# Altium project NewMem.PrjPcb
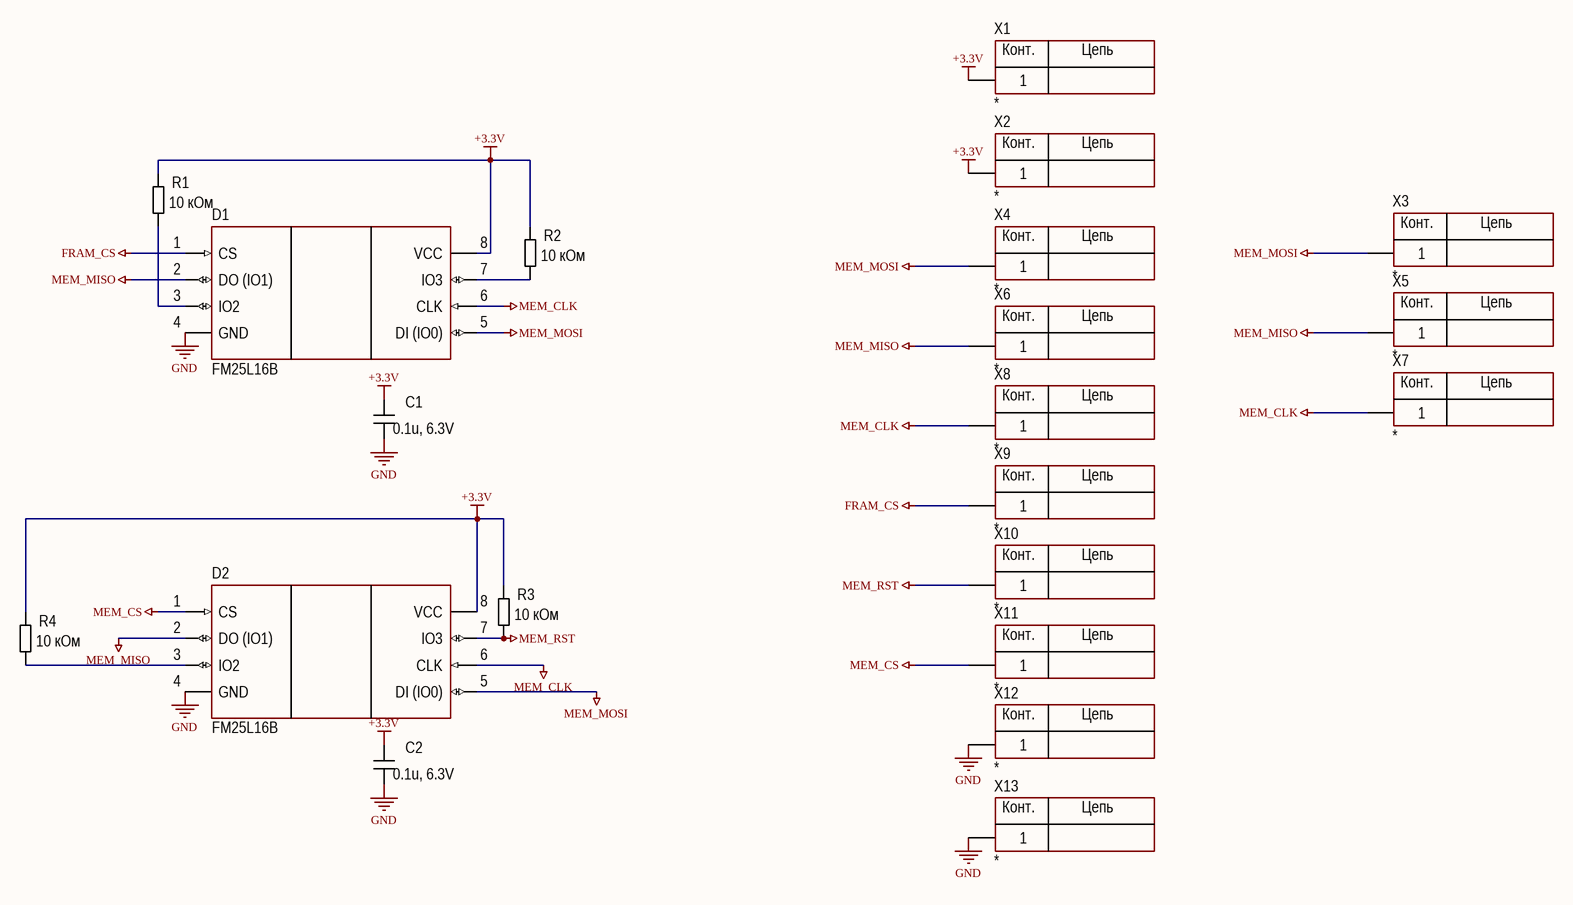
[diagram p0: Sheet1.SchDoc]
1 sheet, 21 parts. Net scope: global (net labels, ports and power ports of the same name join across sheets).
Board file: PCB2.PcbDoc

## Sheet Sheet1.SchDoc
size 414 x 293 mm; SheetNumber: 1; SheetTotal: 1

### Parts
C1  0.1u, 6.3V  [CH0805C]
C2  0.1u, 6.3V  [CH0805C]
D1  FM25L16B  [8-SOIC]
D2  FM25L16B  [8-SOIC]
R1  10 кОм  [CH1206R]
R2  10 кОм  [CH1206R]
R3  10 кОм  [CH1206R]
R4  10 кОм  [CH1206R]
X1  *  [CON: PADS 1x1mm]
X2  *  [CON: PADS 1x1mm]
X3  *  [CON: PADS 1x1mm]
X4  *  [CON: PADS 1x1mm]
X5  *  [CON: PADS 1x1mm]
X6  *  [CON: PADS 1x1mm]
X7  *  [CON: PADS 1x1mm]
X8  *  [CON: PADS 1x1mm]
X9  *  [CON: PADS 1x1mm]
X10  *  [CON: PADS 1x1mm]
X11  *  [CON: PADS 1x1mm]
X12  *  [CON: PADS 1x1mm]
X13  *  [CON: PADS 1x1mm]

### Nets
+3.3V: C1.2 C2.2 D1.8(VCC) D2.8(VCC) R1.2 R2.2 R3.2 R4.2 X1.1 X2.1
FRAM_CS: D1.1(CS) X9.1
GND: C1.1 C2.1 D1.4(GND) D2.4(GND) X12.1 X13.1
MEM_CLK: D1.6(CLK) D2.6(CLK) X7.1 X8.1
MEM_CS: D2.1(CS) X11.1
MEM_MISO: D1.2(DO_(IO1)) D2.2(DO_(IO1)) X5.1 X6.1
MEM_MOSI: D1.5(DI_(IO0)) D2.5(DI_(IO0)) X3.1 X4.1
MEM_RST: D2.7(IO3) R3.1 X10.1
NetD1_3: D1.3(IO2) R1.1
NetD1_7: D1.7(IO3) R2.1
NetD2_3: D2.3(IO2) R4.1

### Notes on the sheet
- Изм.
- Лист
- № докум.
- Подпись
- Дата
- Лит.
- Масса
- Масштаб
- Пров.
- Разраб.
- Т. контр.
- Н. контр.
- Листов
- Утв.
- (in symbol 1-Connector) Конт.; Цепь

### Library data of the parts
C1 C2 = Capacitor: Manufacturer: *; Model: *; HelpURL: *; ComponentKind: *; Value: *
D1 D2 = W25Q80JVSSIQ: Flash; Manufacturer: Winbond Electronics; Model: W25Q80JVSSIQ; HelpURL: https://www.digikey.com/product-detail/en/winbond-electronics/W25Q80JVSSIQ/W25Q80JVSSIQ-ND/6193772; ComponentKind: 8-SOIC
R1-R4 = Resistor: 0603; Manufacturer: *; Model: *; HelpURL: *; ComponentKind: *; Value: *
X1-X13 = 1-Connector: Model: *; Manufacturer: *; HelpURL: *; ComponentKind: *